# EAGLE schematic watchplb_mainboard_v1_0 (EAGLE 6.5.0)

## Sheet 1 of 8: MCU
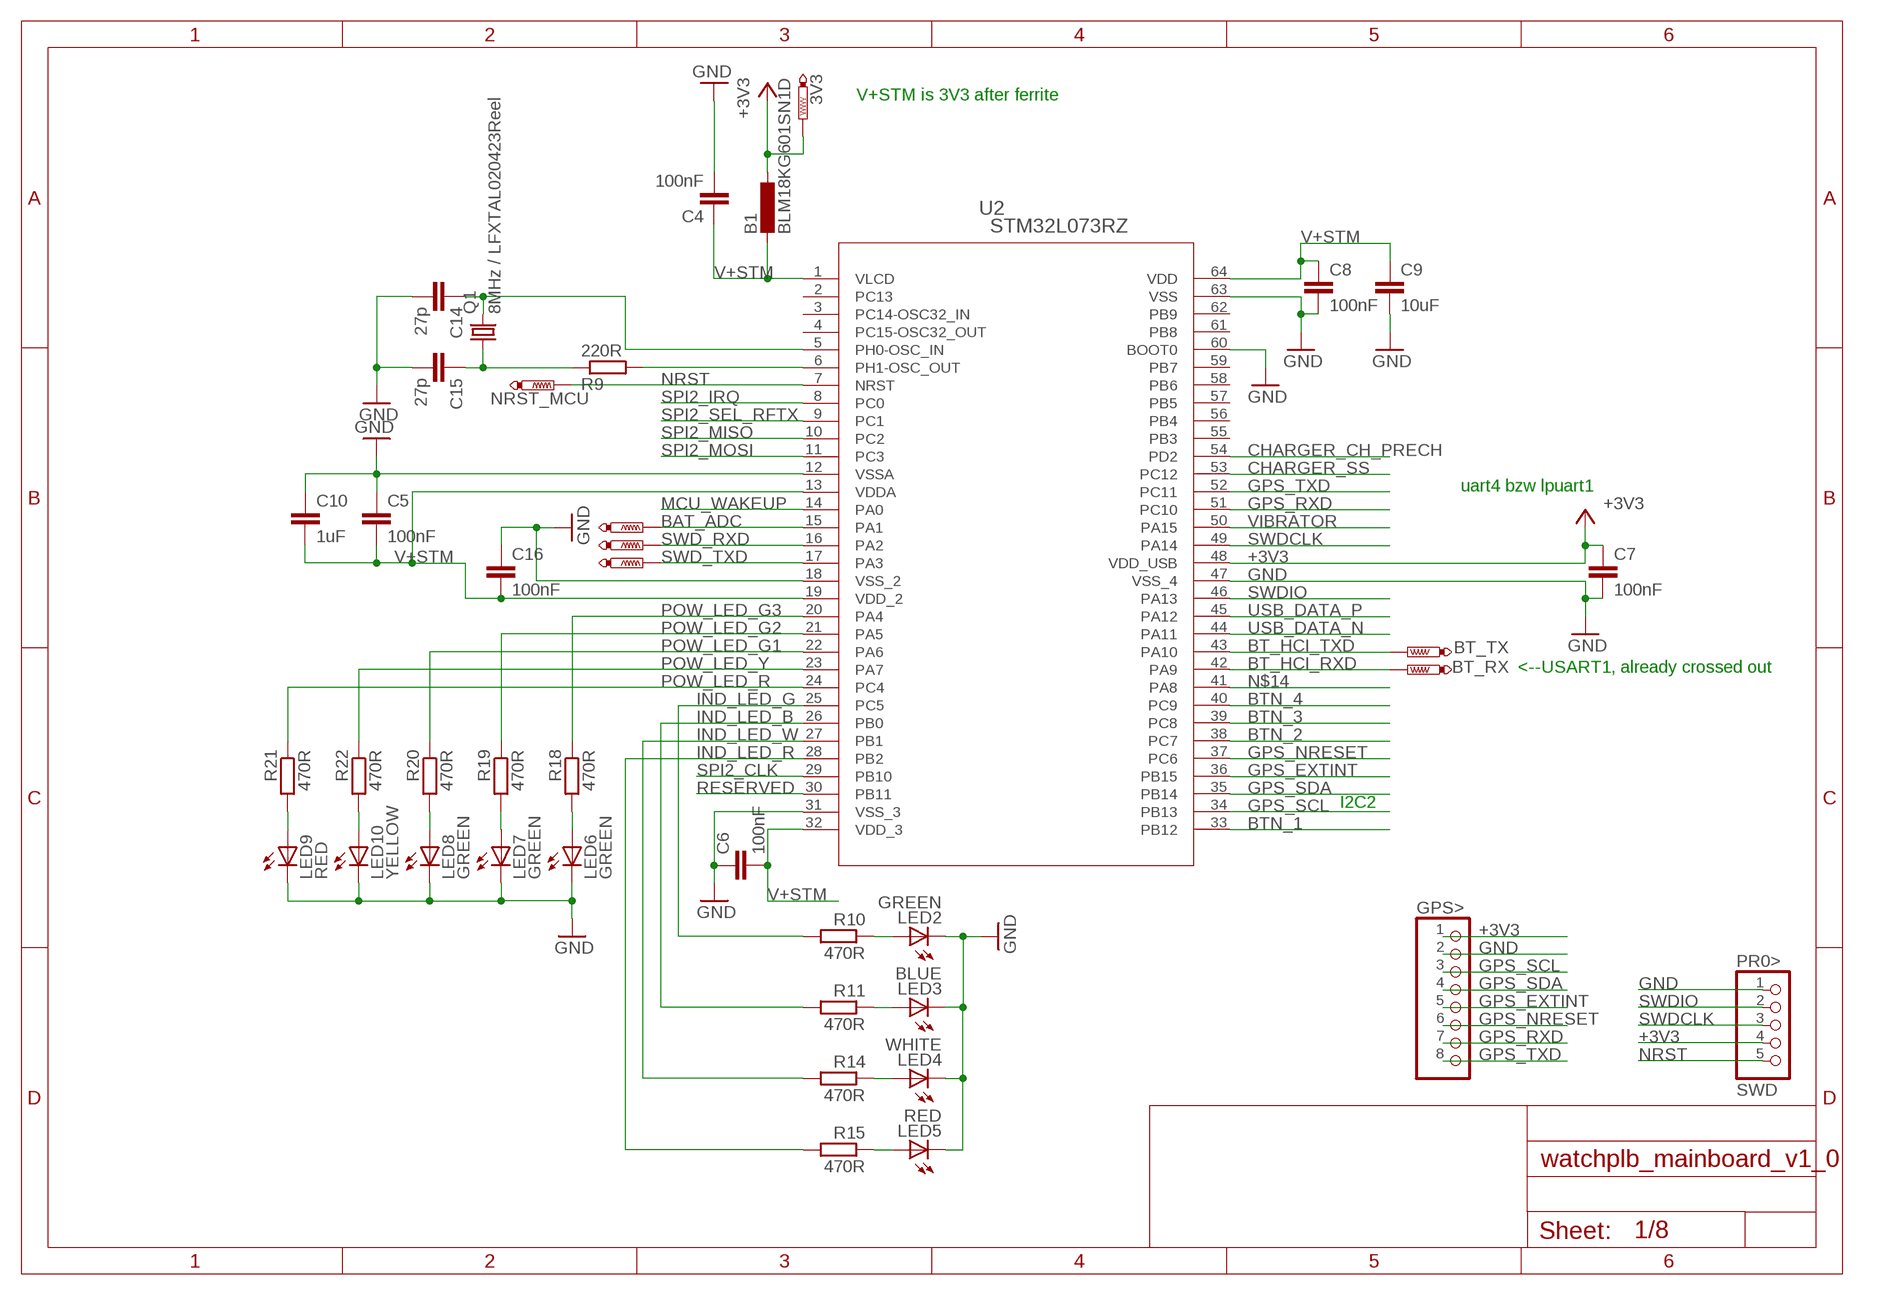
[diagram p0: schematic, sheet 1]

### Parts
3V3  PTR1B1,27  [B1,27]
B1  BLM18KG601SN1D  B-EU_B0603  [L0603]
BAT_ADC  PTR1B1,27  [B1,27]
BT_RX  PTR1B1,27  [B1,27]
BT_TX  PTR1B1,27  [B1,27]
C4  100nF  C-EUC0805  [C0805]
C5  100nF  C-EUC0805  [C0805]
C6  100nF  C-EUC0805  [C0805]
C7  100nF  C-EUC0805  [C0805]
C8  100nF  C-EUC0805  [C0805]
C9  10uF  C-EUC1206  [C1206]
C10  1uF  C-EUC0805  [C0805]
C14  27p  C-EUC0805  [C0805]
C15  27p  C-EUC0805  [C0805]
C16  100nF  C-EUC0805  [C0805]
GPS>  PINHD-1X8  [1X08]
LED2  GREEN  LEDCHIP-LED0805  [CHIP-LED0805]
LED3  BLUE  LEDCHIP-LED0805  [CHIP-LED0805]
LED4  WHITE  LEDCHIP-LED0805  [CHIP-LED0805]
LED5  RED  LEDCHIP-LED0805  [CHIP-LED0805]
LED6  GREEN  LEDCHIP-LED0805  [CHIP-LED0805]
LED7  GREEN  LEDCHIP-LED0805  [CHIP-LED0805]
LED8  GREEN  LEDCHIP-LED0805  [CHIP-LED0805]
LED9  RED  LEDCHIP-LED0805  [CHIP-LED0805]
LED10  YELLOW  LEDCHIP-LED0805  [CHIP-LED0805]
NRST_MCU  PTR1B1,27  [B1,27]
PR0>  SWD  PINHD-1X5  [1X05]
Q1  8MHz / LFXTAL020423Reel  CRYSTALHC49UP  [HC49UP]
R9  220R  R-EU_M0805  [M0805]
R10  470R  R-EU_M0805  [M0805]
R11  470R  R-EU_M0805  [M0805]
R14  470R  R-EU_M0805  [M0805]
R15  470R  R-EU_M0805  [M0805]
R18  470R  R-EU_M0805  [M0805]
R19  470R  R-EU_M0805  [M0805]
R20  470R  R-EU_M0805  [M0805]
R21  470R  R-EU_M0805  [M0805]
R22  470R  R-EU_M0805  [M0805]
SWD_RXD  PTR1B1,27  [B1,27]
SWD_TXD  PTR1B1,27  [B1,27]
U2  STM32L073RZ  STM32L0X3RL  [LQFP64-10X10MM]

### Nets
+3V3: 3V3.TP B1.1 C7.1 GPS>.1 PR0>.4 U2.48(VDD_USB) ; also sheet 2,3,4,5,6,8
BAT_ADC: BAT_ADC.TP U2.15(PA1) ; also sheet 8
BT_HCI_RXD: BT_RX.TP U2.42(PA9) ; also sheet 4
BT_HCI_TXD: BT_TX.TP U2.43(PA10) ; also sheet 4
BTN_1: U2.33(PB12) ; also sheet 3
BTN_2: U2.38(PC7) ; also sheet 3
BTN_3: U2.39(PC8) ; also sheet 3
BTN_4: U2.40(PC9) ; also sheet 3
CHARGER_CH_PRECH: U2.54(PD2) ; also sheet 5
CHARGER_SS: U2.53(PC12) ; also sheet 5
GND: C4.2 C5.1 C6.1 C7.2 C8.2 C9.2 C10.1 C14.2 C15.2 C16.1 GPS>.2 LED2.C LED3.C LED4.C LED5.C LED6.C LED7.C LED8.C LED9.C LED10.C PR0>.1 U2.12(VSSA) U2.18(VSS_2) U2.31(VSS_3) U2.47(VSS_4) U2.60(BOOT0) U2.63(VSS) ; also sheet 2,3,4,5,6,7,8
GPS_EXTINT: GPS>.5 U2.36(PB15)
GPS_NRESET: GPS>.6 U2.37(PC6)
GPS_RXD: GPS>.7 U2.51(PC10)
GPS_SCL: GPS>.3 U2.34(PB13)
GPS_SDA: GPS>.4 U2.35(PB14)
GPS_TXD: GPS>.8 U2.52(PC11)
IND_LED_B: R11.2 U2.26(PB0)
IND_LED_G: R10.2 U2.25(PC5)
IND_LED_R: R15.2 U2.28(PB2)
IND_LED_W: R14.2 U2.27(PB1)
MCU_WAKEUP: U2.14(PA0) ; also sheet 3
N$1: LED2.A R10.1
N$4: LED3.A R11.1
N$5: C15.1 Q1.1 R9.1
N$6: C14.1 Q1.2 U2.5(PH0-OSC_IN)
N$9: R9.2 U2.6(PH1-OSC_OUT)
N$12: LED4.A R14.1
N$13: LED9.A R21.2
N$14: U2.41(PA8)
N$16: LED5.A R15.1
N$19: LED6.A R18.2
N$22: LED7.A R19.2
N$24: LED10.A R22.2
N$25: LED8.A R20.2
NRST: NRST_MCU.TP PR0>.5 U2.7(NRST) ; also sheet 3
POW_LED_G1: R20.1 U2.22(PA6)
POW_LED_G2: R19.1 U2.21(PA5)
POW_LED_G3: R18.1 U2.20(PA4)
POW_LED_R: R21.1 U2.24(PC4)
POW_LED_Y: R22.1 U2.23(PA7)
RESERVED: U2.30(PB11)
SPI2_CLK: U2.29(PB10) ; also sheet 2
SPI2_IRQ: U2.8(PC0) ; also sheet 2
SPI2_MISO: U2.10(PC2) ; also sheet 2
SPI2_MOSI: U2.11(PC3) ; also sheet 2
SPI2_SEL_RFTX: U2.9(PC1) ; also sheet 2
SWD_RXD: SWD_RXD.TP U2.16(PA2)
SWD_TXD: SWD_TXD.TP U2.17(PA3)
SWDCLK: PR0>.3 U2.49(PA14)
SWDIO: PR0>.2 U2.46(PA13)
USB_DATA_N: U2.44(PA11) ; also sheet 6
USB_DATA_P: U2.45(PA12) ; also sheet 6
V+STM: B1.2 C4.1 C5.2 C6.2 C8.1 C9.1 C10.2 C16.2 U2.1(VLCD) U2.13(VDDA) U2.19(VDD_2) U2.32(VDD_3) U2.64(VDD)
VIBRATOR: U2.50(PA15) ; also sheet 3
Unconnected: U2.2(PC13) U2.3(PC14-OSC32_IN) U2.4(PC15-OSC32_OUT) U2.55(PB3) U2.56(PB4) U2.57(PB5) U2.58(PB6) U2.59(PB7) U2.61(PB8) U2.62(PB9)

### Notes on the sheet
- V+STM is 3V3 after ferrite
- uart4 bzw lpuart1
- <--USART1, already crossed out
- I2C2

## Sheet 2 of 8: FUNK
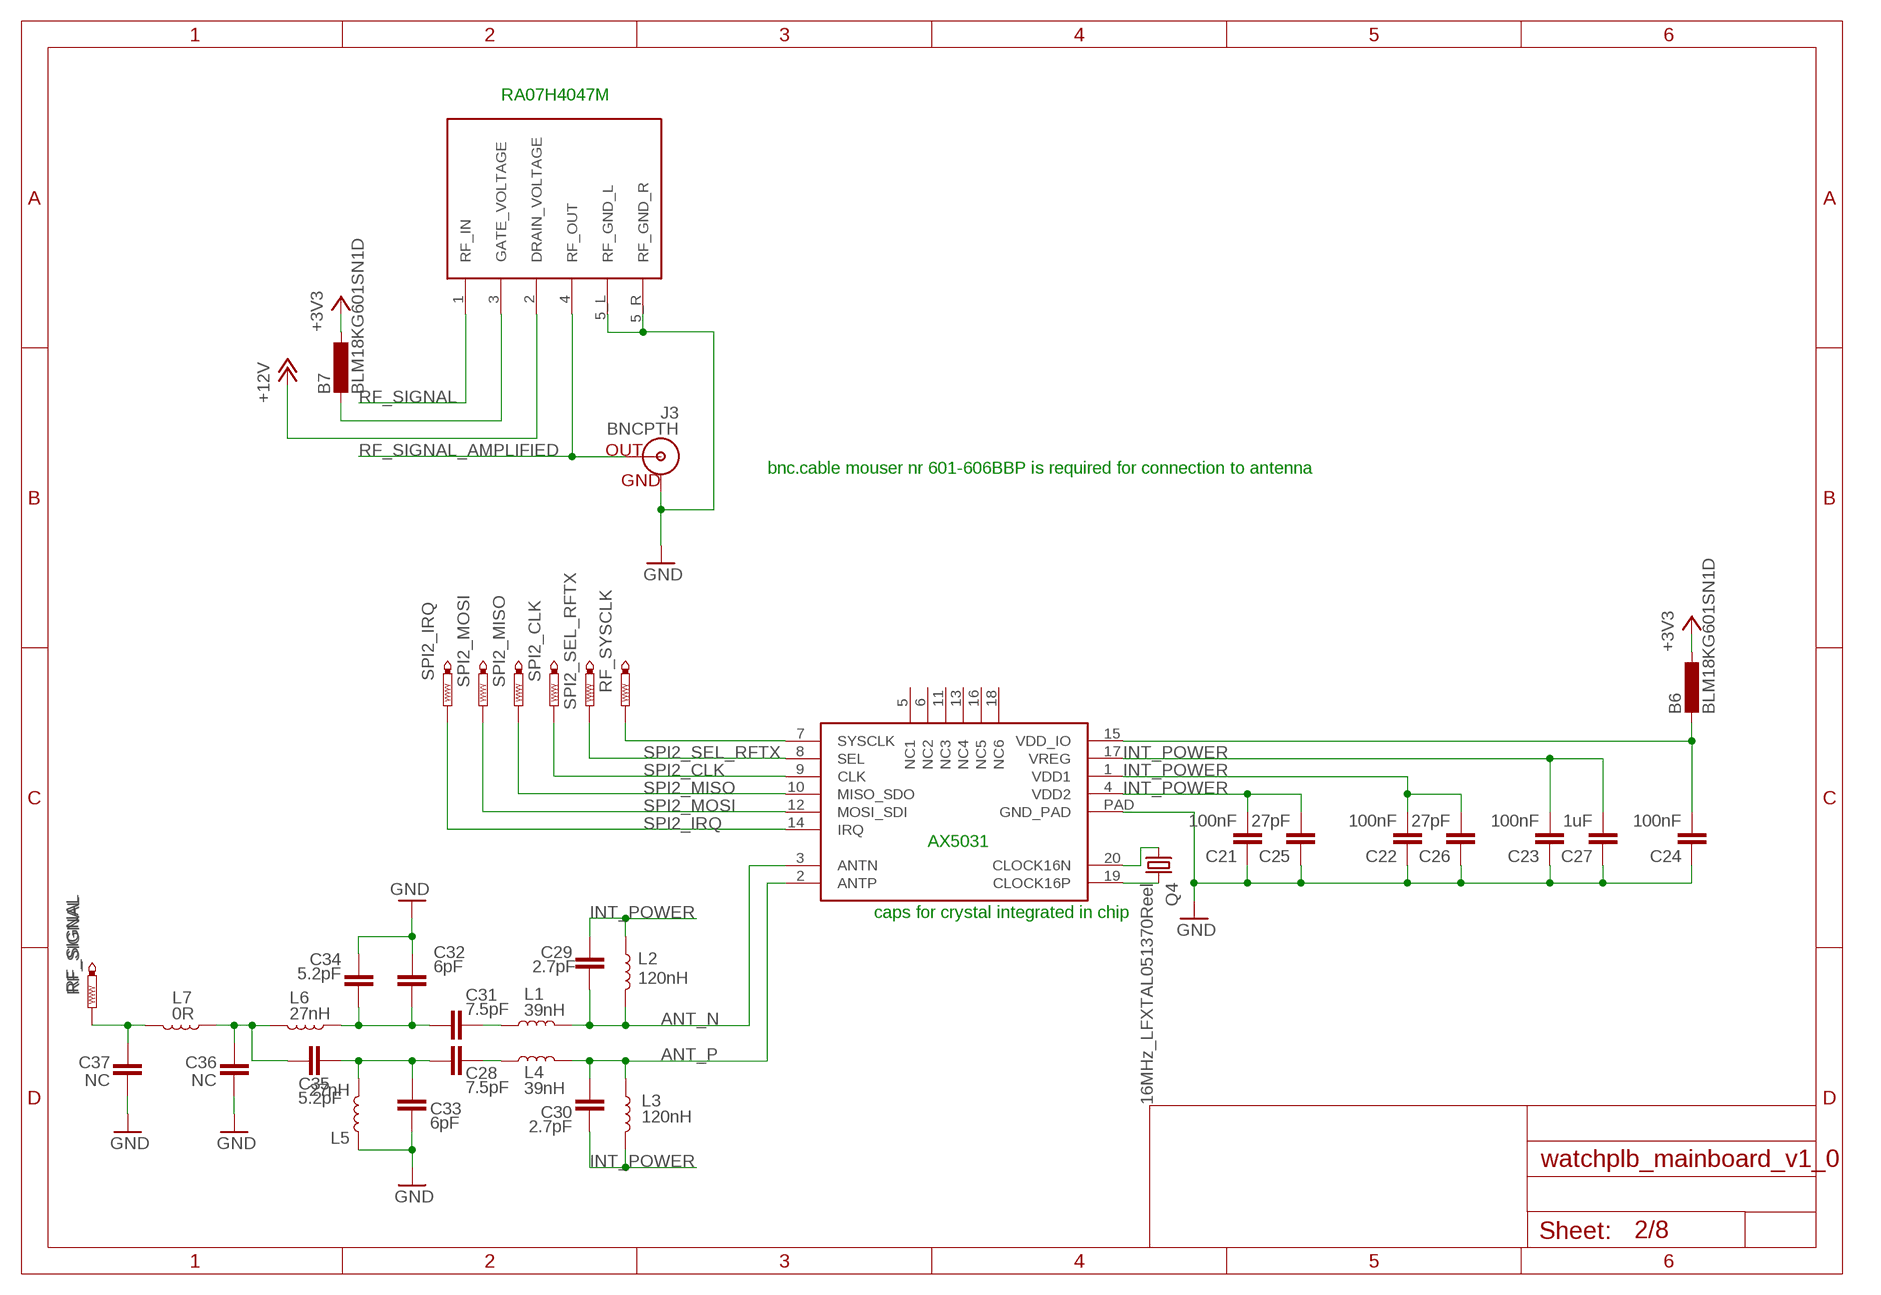
[diagram p1: schematic, sheet 2]

### Parts
B6  BLM18KG601SN1D  B-EU_B0603  [L0603]
B7  BLM18KG601SN1D  B-EU_B0603  [L0603]
C21  100nF  C-EUC0805  [C0805]
C22  100nF  C-EUC0805  [C0805]
C23  100nF  C-EUC0805  [C0805]
C24  100nF  C-EUC0805  [C0805]
C25  27pF  C-EUC0805  [C0805]
C26  27pF  C-EUC0805  [C0805]
C27  1uF  C-EUC0805  [C0805]
C28  7.5pF  C-EUC0805  [C0805]
C29  2.7pF  C-EUC0805  [C0805]
C30  2.7pF  C-EUC0805  [C0805]
C31  7.5pF  C-EUC0805  [C0805]
C32  6pF  C-EUC0805  [C0805]
C33  6pF  C-EUC0805  [C0805]
C34  5.2pF  C-EUC0805  [C0805]
C35  5.2pF  C-EUC0805  [C0805]
C36  NC  C-EUC0805  [C0805]
C37  NC  C-EUC0805  [C0805]
IC4  AX5031  [QFN20]
J3  BNCPTH  [BNC]
L1  39nH  INDUCTOR-0805-3.3UH  [0805]
L2  120nH  INDUCTOR-0805-3.3UH  [0805]
L3  120nH  INDUCTOR-0805-3.3UH  [0805]
L4  39nH  INDUCTOR-0805-3.3UH  [0805]
L5  27nH  INDUCTOR-0805-3.3UH  [0805]
L6  27nH  INDUCTOR-0805-3.3UH  [0805]
L7  0R  INDUCTOR-0805-3.3UH  [0805]
Q4  16MHz_LFXTAL051370Reel  CRYSTALHC49UP  [HC49UP]
RF_SIGNAL  PTR1B2,54  [B2,54]
RF_SYSCLK  PTR1B1,27  [B1,27]
SPI2_CLK  PTR1B1,27  [B1,27]
SPI2_IRQ  PTR1B1,27  [B1,27]
SPI2_MISO  PTR1B1,27  [B1,27]
SPI2_MOSI  PTR1B1,27  [B1,27]
SPI2_SEL_RFTX  PTR1B1,27  [B1,27]
U$2  RA07H4047M  [RA07H4047M]

### Nets
+3V3: B6.1 B7.1 ; also sheet 1,3,4,5,6,8
+12V: U$2.2(DRAIN_VOLTAGE) ; also sheet 8
ANT_N: C29.1 IC4.3(ANTN) L1.2 L2.2
ANT_P: C30.2 IC4.2(ANTP) L3.1 L4.2
GND: C21.1 C22.1 C23.1 C24.1 C25.1 C26.1 C27.1 C32.1 C33.2 C34.1 C36.1 C37.1 IC4.PAD(GND_PAD) J3.GND L5.1 U$2.5_L(RF_GND_L) U$2.5_R(RF_GND_R) ; also sheet 1,3,4,5,6,7,8
INT_POWER: C21.2 C22.2 C23.2 C25.2 C26.2 C27.2 C29.2 C30.1 IC4.1(VDD1) IC4.4(VDD2) IC4.17(VREG) L2.1 L3.2
N$33: IC4.19(CLOCK16P) Q4.2
N$34: IC4.20(CLOCK16N) Q4.1
N$37: IC4.7(SYSCLK) RF_SYSCLK.TP
N$39: C28.1 L4.1
N$40: C31.1 L1.1
N$42: C31.2 C32.2 C34.2 L6.1
N$43: C28.2 C33.1 C35.2 L5.2
N$45: C35.1 C36.2 L6.2 L7.1
N$82: B6.2 C24.2 IC4.15(VDD_IO)
N$83: B7.2 U$2.3(GATE_VOLTAGE)
RF_SIGNAL: C37.2 L7.2 RF_SIGNAL.TP U$2.1(RF_IN)
RF_SIGNAL_AMPLIFIED: J3.S(OUT) U$2.4(RF_OUT)
SPI2_CLK: IC4.9(CLK) SPI2_CLK.TP ; also sheet 1
SPI2_IRQ: IC4.14(IRQ) SPI2_IRQ.TP ; also sheet 1
SPI2_MISO: IC4.10(MISO_SDO) SPI2_MISO.TP ; also sheet 1
SPI2_MOSI: IC4.12(MOSI_SDI) SPI2_MOSI.TP ; also sheet 1
SPI2_SEL_RFTX: IC4.8(SEL) SPI2_SEL_RFTX.TP ; also sheet 1
Unconnected: IC4.5(NC1) IC4.6(NC2) IC4.11(NC3) IC4.13(NC4) IC4.16(NC5) IC4.18(NC6)

### Notes on the sheet
- RA07H4047M
- bnc.cable mouser nr 601-606BBP is required for connection to antenna
- AX5031
- caps for crystal integrated in chip

## Sheet 3 of 8: BTN
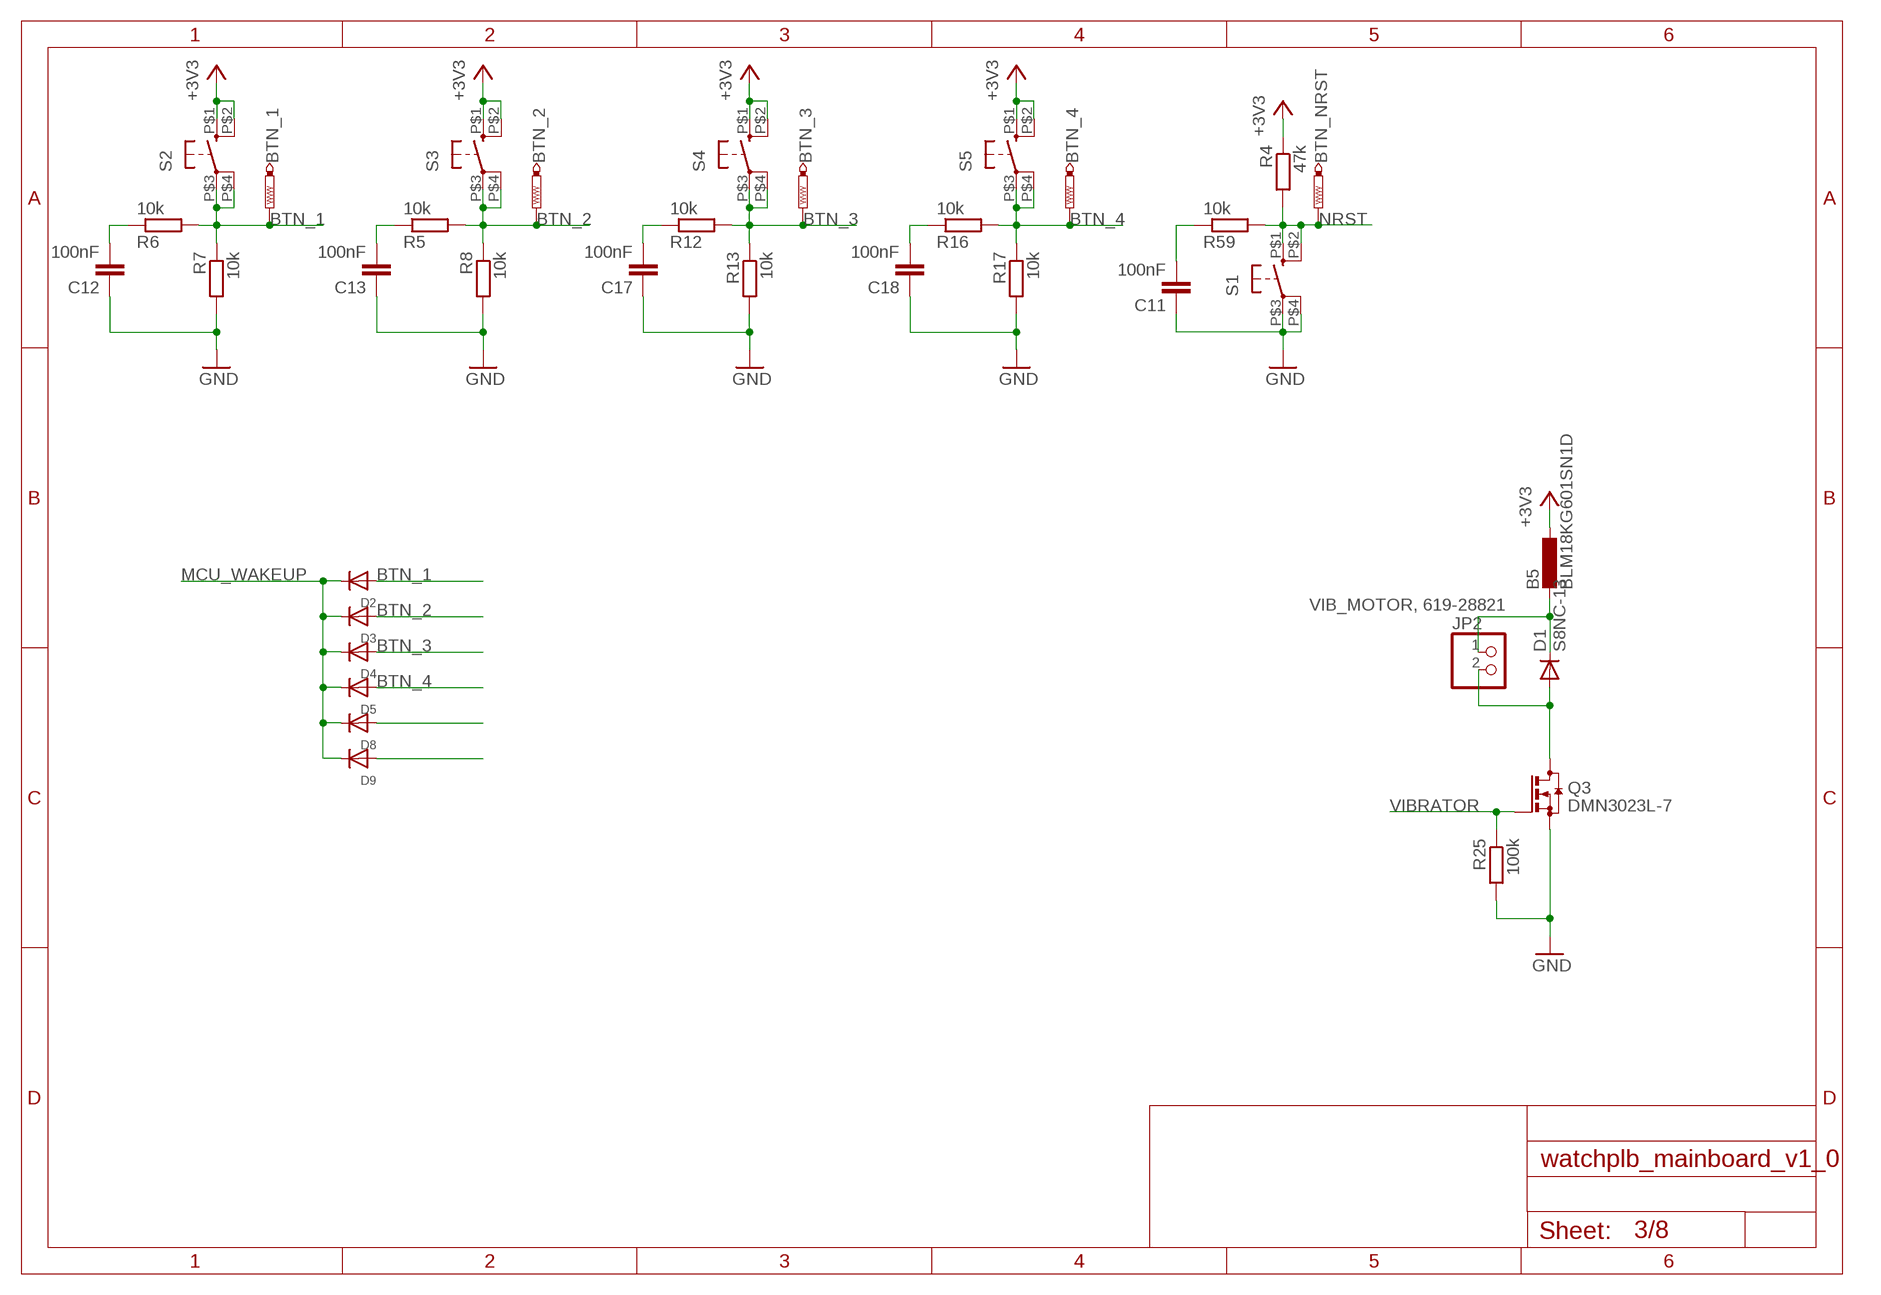
[diagram p2: schematic, sheet 3]

### Parts
B5  BLM18KG601SN1D  B-EU_B0603  [L0603]
BTN_1  PTR1B1,27  [B1,27]
BTN_2  PTR1B1,27  [B1,27]
BTN_3  PTR1B1,27  [B1,27]
BTN_4  PTR1B1,27  [B1,27]
BTN_NRST  PTR1B1,27  [B1,27]
C11  100nF  C-EUC0805  [C0805]
C12  100nF  C-EUC0805  [C0805]
C13  100nF  C-EUC0805  [C0805]
C17  100nF  C-EUC0805  [C0805]
C18  100nF  C-EUC0805  [C0805]
D1  S8NC-13  DIODE-SMC  [SMC]
D2  DIODESOD-123  [SOD-123]
D3  DIODESOD-123  [SOD-123]
D4  DIODESOD-123  [SOD-123]
D5  DIODESOD-123  [SOD-123]
D8  DIODESOD-123  [SOD-123]
D9  DIODESOD-123  [SOD-123]
JP2  VIB_MOTOR, 619-28821  PINHD-1X2  [1X02]
Q3  DMN3023L-7  BSS123  [SOT23]
R4  47k  R-EU_M0805  [M0805]
R5  10k  R-EU_M0805  [M0805]
R6  10k  R-EU_M0805  [M0805]
R7  10k  R-EU_M0805  [M0805]
R8  10k  R-EU_M0805  [M0805]
R12  10k  R-EU_M0805  [M0805]
R13  10k  R-EU_M0805  [M0805]
R16  10k  R-EU_M0805  [M0805]
R17  10k  R-EU_M0805  [M0805]
R25  100k  R-EU_M0805  [M0805]
R59  10k  R-EU_M0805  [M0805]
S1  TL3305  [SMD_SWITCH]
S2  TL3305  [SMD_SWITCH]
S3  TL3305  [SMD_SWITCH]
S4  TL3305  [SMD_SWITCH]
S5  TL3305  [SMD_SWITCH]

### Nets
+3V3: B5.1 R4.1 S2.P$1(SL1) S2.P$2(SL2) S3.P$1(SL1) S3.P$2(SL2) S4.P$1(SL1) S4.P$2(SL2) S5.P$1(SL1) S5.P$2(SL2) ; also sheet 1,2,4,5,6,8
BTN_1: BTN_1.TP D2.A R6.2 R7.1 S2.P$3(SR1) S2.P$4(SR2) ; also sheet 1
BTN_2: BTN_2.TP D3.A R5.2 R8.1 S3.P$3(SR1) S3.P$4(SR2) ; also sheet 1
BTN_3: BTN_3.TP D4.A R12.2 R13.1 S4.P$3(SR1) S4.P$4(SR2) ; also sheet 1
BTN_4: BTN_4.TP D5.A R16.2 R17.1 S5.P$3(SR1) S5.P$4(SR2) ; also sheet 1
GND: C11.1 C12.1 C13.1 C17.1 C18.1 Q3.2(S) R7.2 R8.2 R13.2 R17.2 R25.2 S1.P$3(SR1) S1.P$4(SR2) ; also sheet 1,2,4,5,6,7,8
MCU_WAKEUP: D2.C D3.C D4.C D5.C D8.C D9.C ; also sheet 1
N$2: C12.2 R6.1
N$7: C13.2 R5.1
N$11: C17.2 R12.1
N$18: C18.2 R16.1
N$28: D1.A JP2.2 Q3.3(D)
N$67: D8.A
N$68: D9.A
N$81: B5.2 D1.C JP2.1
N$86: C11.2 R59.1
NRST: BTN_NRST.TP R4.2 R59.2 S1.P$1(SL1) S1.P$2(SL2) ; also sheet 1
VIBRATOR: Q3.1(G) R25.1 ; also sheet 1

## Sheet 4 of 8: BT
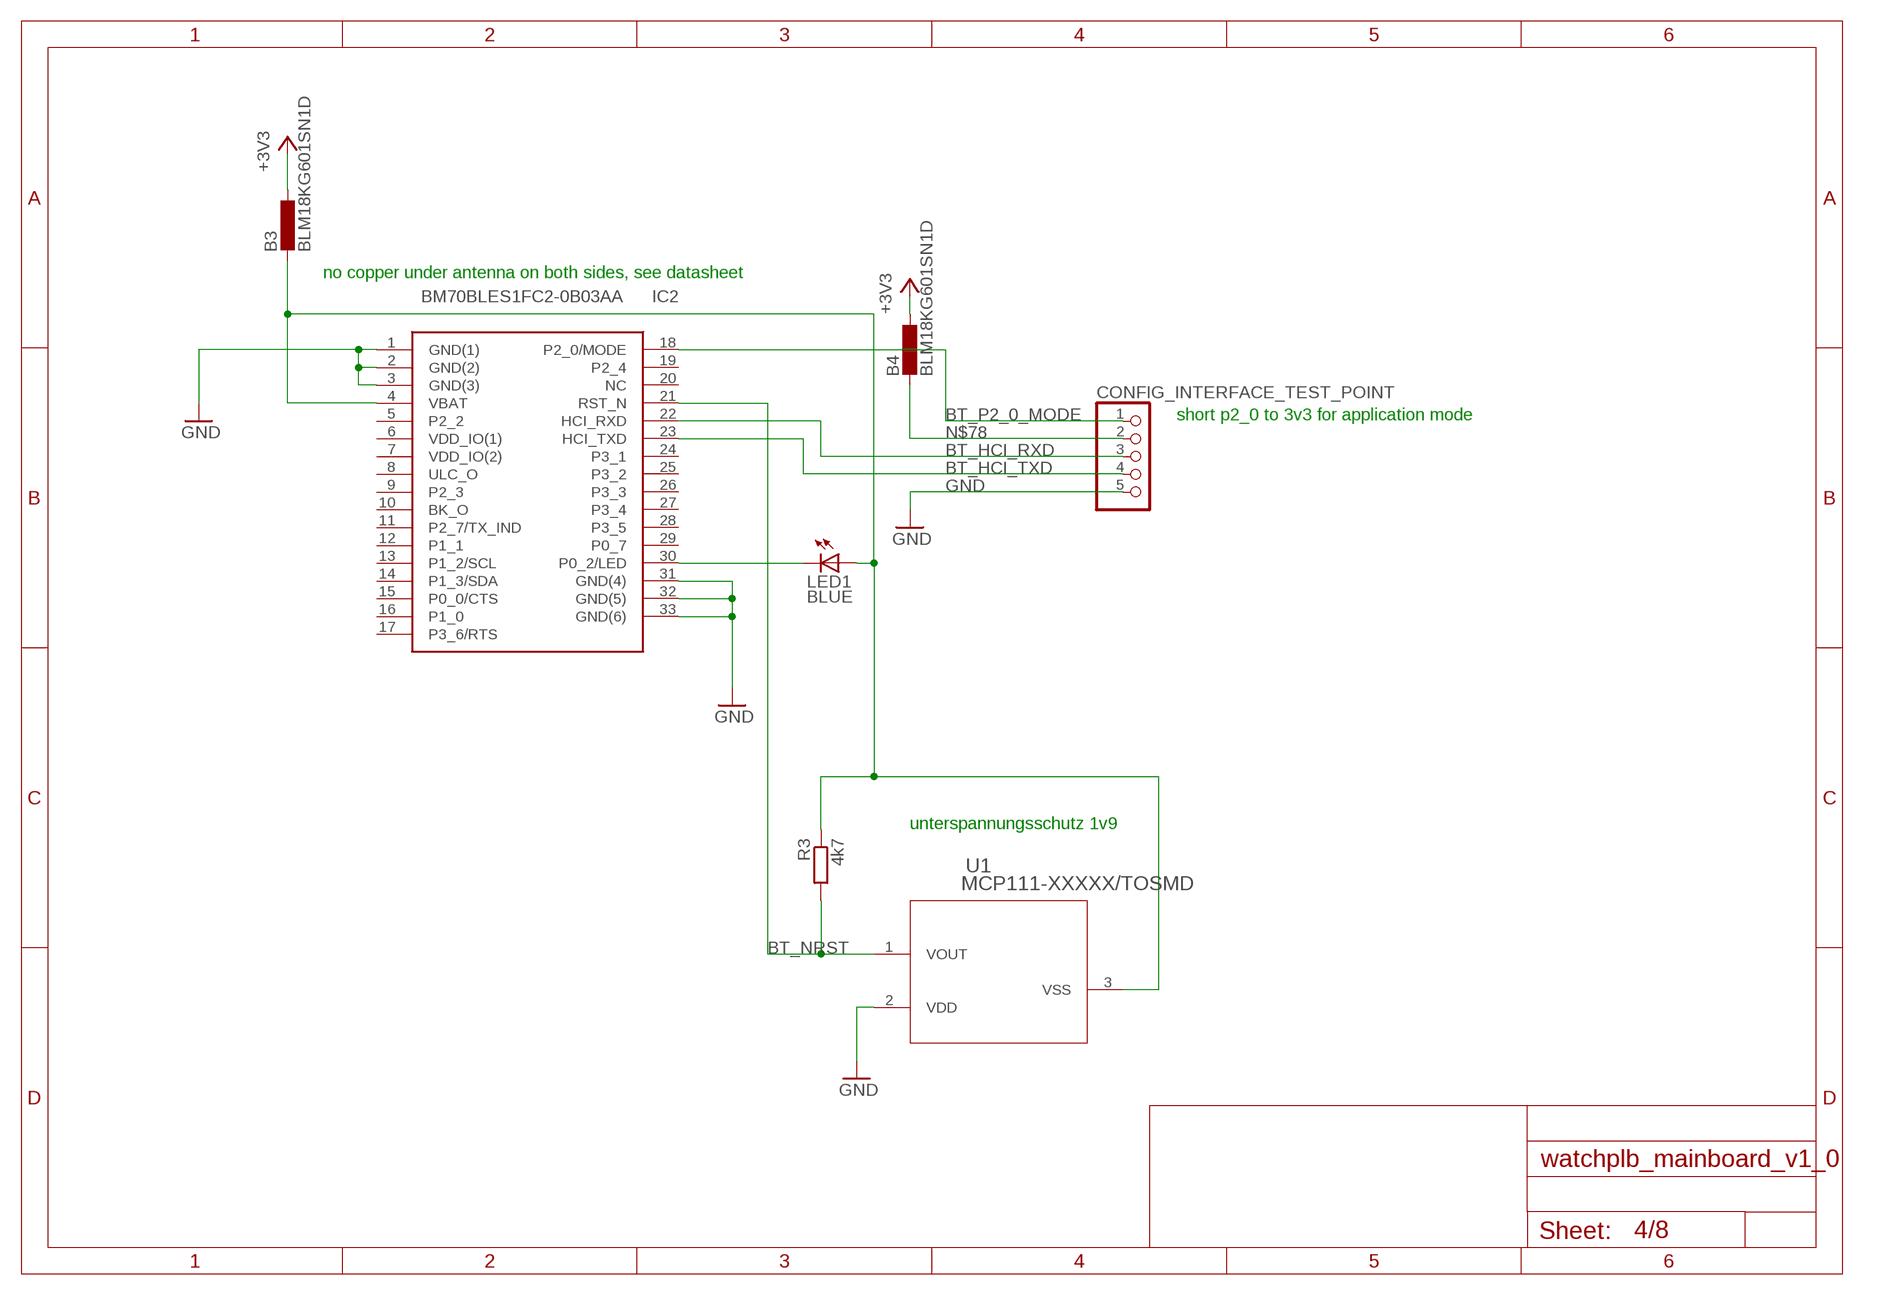
[diagram p3: schematic, sheet 4]

### Parts
B3  BLM18KG601SN1D  B-EU_B0603  [L0603]
B4  BLM18KG601SN1D  B-EU_B0603  [L0603]
CONFIG_INTERFACE_TEST_POINT  PINHD-1X5  [1X05]
IC2  BM70BLES1FC2-0B03AA  [BM78SPPS5NC2_1]
LED1  BLUE  LEDCHIP-LED0805  [CHIP-LED0805]
R3  4k7  R-EU_M0805  [M0805]
U1  MCP111-XXXXX/TOSMD  [SC70-3-R]

### Nets
+3V3: B3.1 B4.1 ; also sheet 1,2,3,5,6,8
BT_HCI_RXD: CONFIG_INTERFACE_TEST_POINT.3 IC2.22(HCI_RXD) ; also sheet 1
BT_HCI_TXD: CONFIG_INTERFACE_TEST_POINT.4 IC2.23(HCI_TXD) ; also sheet 1
BT_NRST: IC2.21(RST_N) R3.2 U1.1(VOUT)
BT_P2_0_MODE: CONFIG_INTERFACE_TEST_POINT.1 IC2.18(P2_0/MODE)
GND: CONFIG_INTERFACE_TEST_POINT.5 IC2.1(GND(1)) IC2.2(GND(2)) IC2.3(GND(3)) IC2.31(GND(4)) IC2.32(GND(5)) IC2.33(GND(6)) U1.2(VDD) ; also sheet 1,2,3,5,6,7,8
N$3: IC2.30(P0_2/LED) LED1.C
N$78: B4.2 CONFIG_INTERFACE_TEST_POINT.2
N$80: B3.2 IC2.4(VBAT) LED1.A R3.1 U1.3(VSS)
Unconnected: IC2.5(P2_2) IC2.6(VDD_IO(1)) IC2.7(VDD_IO(2)) IC2.8(ULC_O) IC2.9(P2_3) IC2.10(BK_O) IC2.11(P2_7/TX_IND) IC2.12(P1_1) IC2.13(P1_2/SCL) IC2.14(P1_3/SDA) IC2.15(P0_0/CTS) IC2.16(P1_0) IC2.17(P3_6/RTS) IC2.19(P2_4) IC2.20(NC) IC2.24(P3_1) IC2.25(P3_2) IC2.26(P3_3) IC2.27(P3_4) IC2.28(P3_5) IC2.29(P0_7)

### Notes on the sheet
- no copper under antenna on both sides, see datasheet
- short p2_0 to 3v3 for application mode
- unterspannungsschutz 1v9

## Sheet 5 of 8: CHG
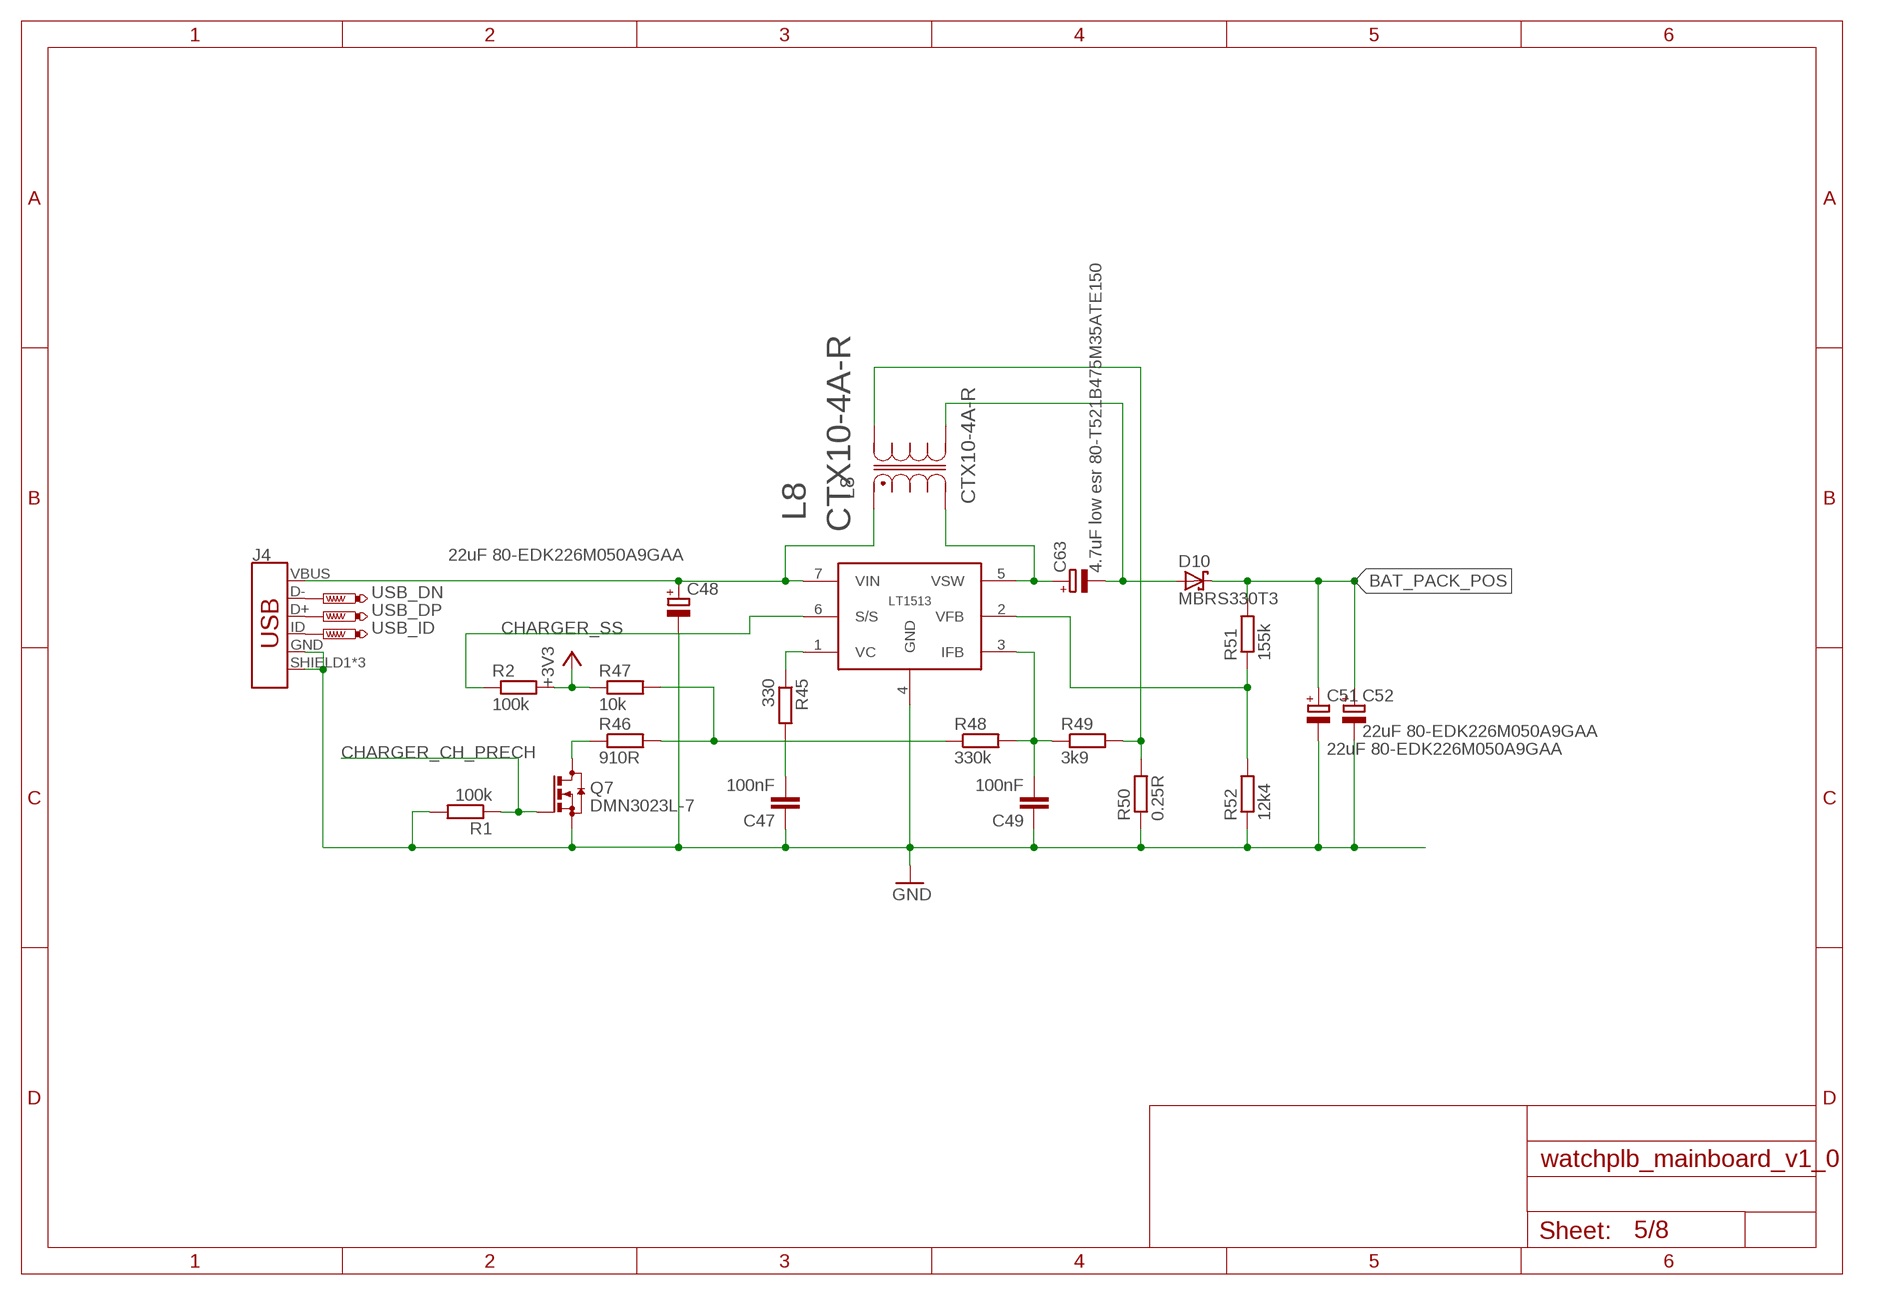
[diagram p4: schematic, sheet 5]

### Parts
C47  100nF  C-EUC0805K  [C0805K]
C48  22uF 80-EDK226M050A9GAA  CPOL-EUE  [PANASONIC_E]
C49  100nF  C-EUC0805K  [C0805K]
C51  22uF 80-EDK226M050A9GAA  CPOL-EUE  [PANASONIC_E]
C52  22uF 80-EDK226M050A9GAA  CPOL-EUE  [PANASONIC_E]
C63  4.7uF low esr 80-T521B475M35ATE150  CPOL-EUB/3528-21R  [B/3528-21R]
D10  MBRS330T3  [SMC]
IC1  LT1513  [TO220-7]
J4  USB_MICRO-B_FEMALE-SMT  [USB-B-MICRO-SMD]
L8  CTX10-4A-R  [INDM115115X635N]
Q7  DMN3023L-7  BSS123  [SOT23]
R1  100k  R-EU_M0805  [M0805]
R2  100k  R-EU_M0805  [M0805]
R45  330  R-EU_M0805  [M0805]
R46  910R  R-EU_M0805  [M0805]
R47  10k  R-EU_M0805  [M0805]
R48  330k  R-EU_M0805  [M0805]
R49  3k9  R-EU_M0805  [M0805]
R50  0.25R  R-EU_R2512  [R2512]
R51  155k  R-EU_M0805  [M0805]
R52  12k4  R-EU_M0805  [M0805]
USB_DN  PTR1B1,27  [B1,27]
USB_DP  PTR1B1,27  [B1,27]
USB_ID  PTR1B1,27  [B1,27]

### Nets
+3V3: R2.2 R47.1 ; also sheet 1,2,3,4,6,8
BAT_PACK_POS: C51.+ C52.+ D10.C R51.2 ; also sheet 7,8
CHARGER_CH_PRECH: Q7.1(G) R1.1 ; also sheet 1
CHARGER_SS: IC1.6(S/S) R2.1 ; also sheet 1
GND: C47.1 C48.- C49.1 C51.- C52.- IC1.4(GND) J4.GND J4.SHIELD1(SHIELD) J4.SHIELD2(SHIELD) J4.SHIELD3(SHIELD) Q7.2(S) R1.2 R50.1 R52.1 ; also sheet 1,2,3,4,6,7,8
N$61: C63.+ IC1.5(VSW) L8.2
N$69: C48.+ IC1.7(VIN) J4.VBUS L8.1
N$70: L8.4 R49.2 R50.2
N$71: C47.2 R45.2
N$72: IC1.1(VC) R45.1
N$73: Q7.3(D) R46.1
N$74: R46.2 R47.2 R48.1
N$76: C49.2 IC1.3(IFB) R48.2 R49.1
N$77: IC1.2(VFB) R51.1 R52.2
N$87: J4.ID USB_ID.TP
N$88: J4.D+ USB_DP.TP
N$90: J4.D- USB_DN.TP
N$91: C63.- D10.A L8.3

## Sheet 6 of 8: Debug
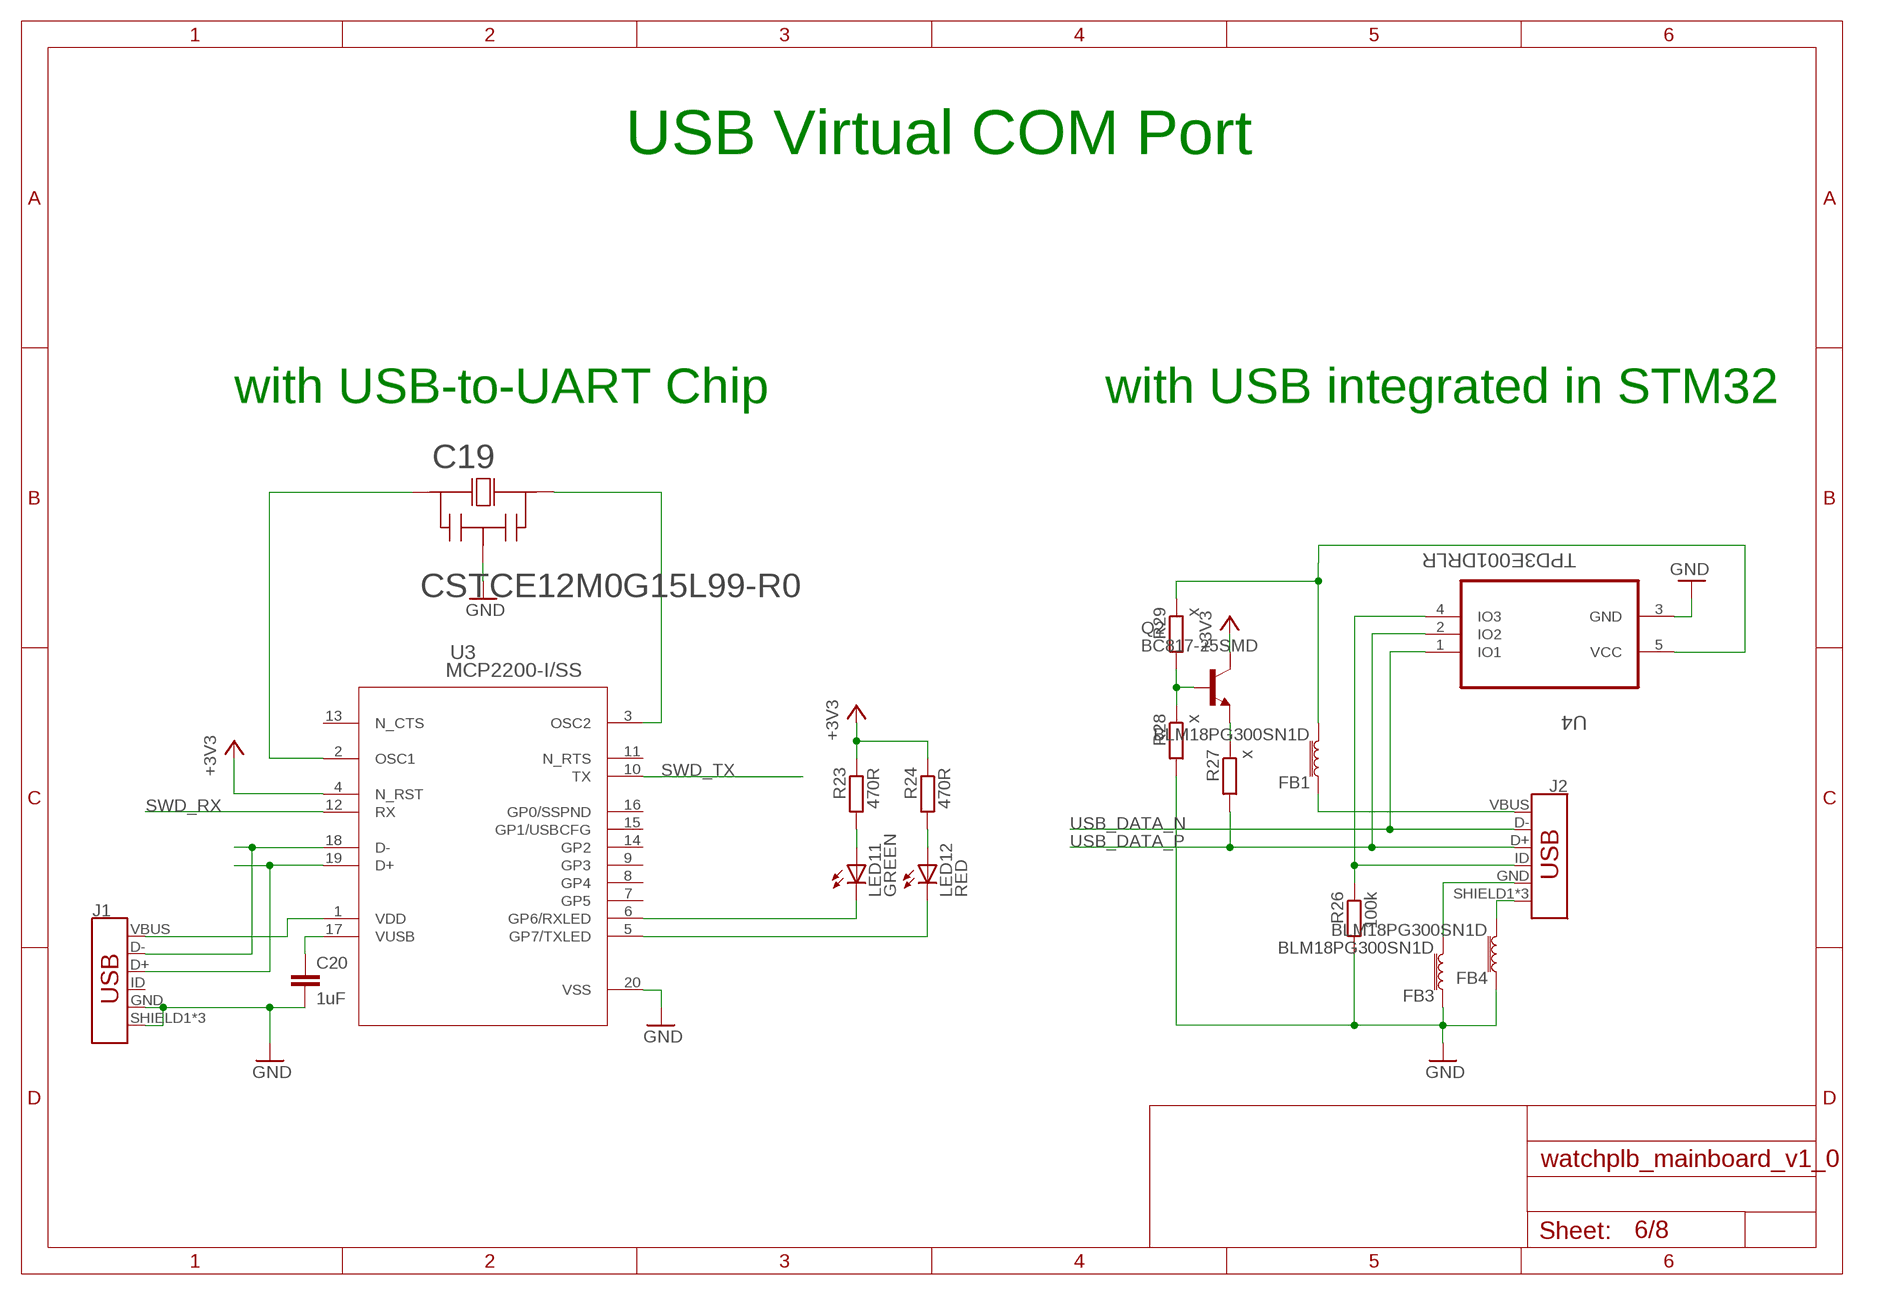
[diagram p5: schematic, sheet 6]

### Parts
C19  CSTCE12M0G15L99-R0  CSTCE8M00G52-R0  [CSTCE]
C20  1uF  C-EUC0805  [C0805]
FB1  BLM18PG300SN1D  FERRITE_BEAD-0603  [0603]
FB3  BLM18PG300SN1D  FERRITE_BEAD-0603  [0603]
FB4  BLM18PG300SN1D  FERRITE_BEAD-0603  [0603]
J1  USB_MICRO-B_FEMALE-SMT  [USB-B-MICRO-SMD]
J2  USB_MICRO-B_FEMALE-SMT  [USB-B-MICRO-SMD]
LED11  GREEN  LEDCHIP-LED0805  [CHIP-LED0805]
LED12  RED  LEDCHIP-LED0805  [CHIP-LED0805]
Q2  BC817-25SMD  [SOT23-BEC]
R23  470R  R-EU_M0805  [M0805]
R24  470R  R-EU_M0805  [M0805]
R26  100k  R-EU_M0805  [M0805]
R27  x  R-EU_M0805  [M0805]
R28  x  R-EU_M0805  [M0805]
R29  x  R-EU_M0805  [M0805]
U3  MCP2200-I/SS  [SSOP20_MC]
U4  TPD3E001DRLR  [SOT50P160X60-5N]

### Nets
+3V3: Q2.C R23.1 R24.1 U3.4(N_RST) ; also sheet 1,2,3,4,5,8
GND: C19.2 C20.2 FB3.1 FB4.1 J1.GND J1.SHIELD1(SHIELD) J1.SHIELD2(SHIELD) J1.SHIELD3(SHIELD) R26.2 R28.2 U3.20(VSS) U4.3(GND) ; also sheet 1,2,3,4,5,7,8
N$8: LED11.A R23.2
N$10: C19.3 U3.3(OSC2)
N$15: C19.1 U3.2(OSC1)
N$17: J1.D- U3.18(D-)
N$20: J1.D+ U3.19(D+)
N$21: C20.1 U3.17(VUSB)
N$23: LED12.A R24.2
N$26: LED11.C U3.6(GP6/RXLED)
N$27: LED12.C U3.5(GP7/TXLED)
N$29: FB4.2 J2.SHIELD1(SHIELD) J2.SHIELD2(SHIELD) J2.SHIELD3(SHIELD)
N$30: FB3.2 J2.GND
N$31: FB1.1 J2.VBUS
N$32: J2.ID R26.1 U4.4(IO3)
N$35: Q2.E R27.1
N$36: Q2.B R28.1 R29.2
N$41: J1.VBUS U3.1(VDD)
N$44: FB1.2 R29.1 U4.5(VCC)
SWD_RX: U3.12(RX)
SWD_TX: U3.10(TX)
USB_DATA_N: J2.D- U4.1(IO1) ; also sheet 1
USB_DATA_P: J2.D+ R27.2 U4.2(IO2) ; also sheet 1
Unconnected: J1.ID U3.7(GP5) U3.8(GP4) U3.9(GP3) U3.11(N_RTS) U3.13(N_CTS) U3.14(GP2) U3.15(GP1/USBCFG) U3.16(GP0/SSPND)

### Notes on the sheet
- USB Virtual COM Port
- with USB-to-UART Chip | with USB integrated in STM32

## Sheet 7 of 8: Bat. Prot.
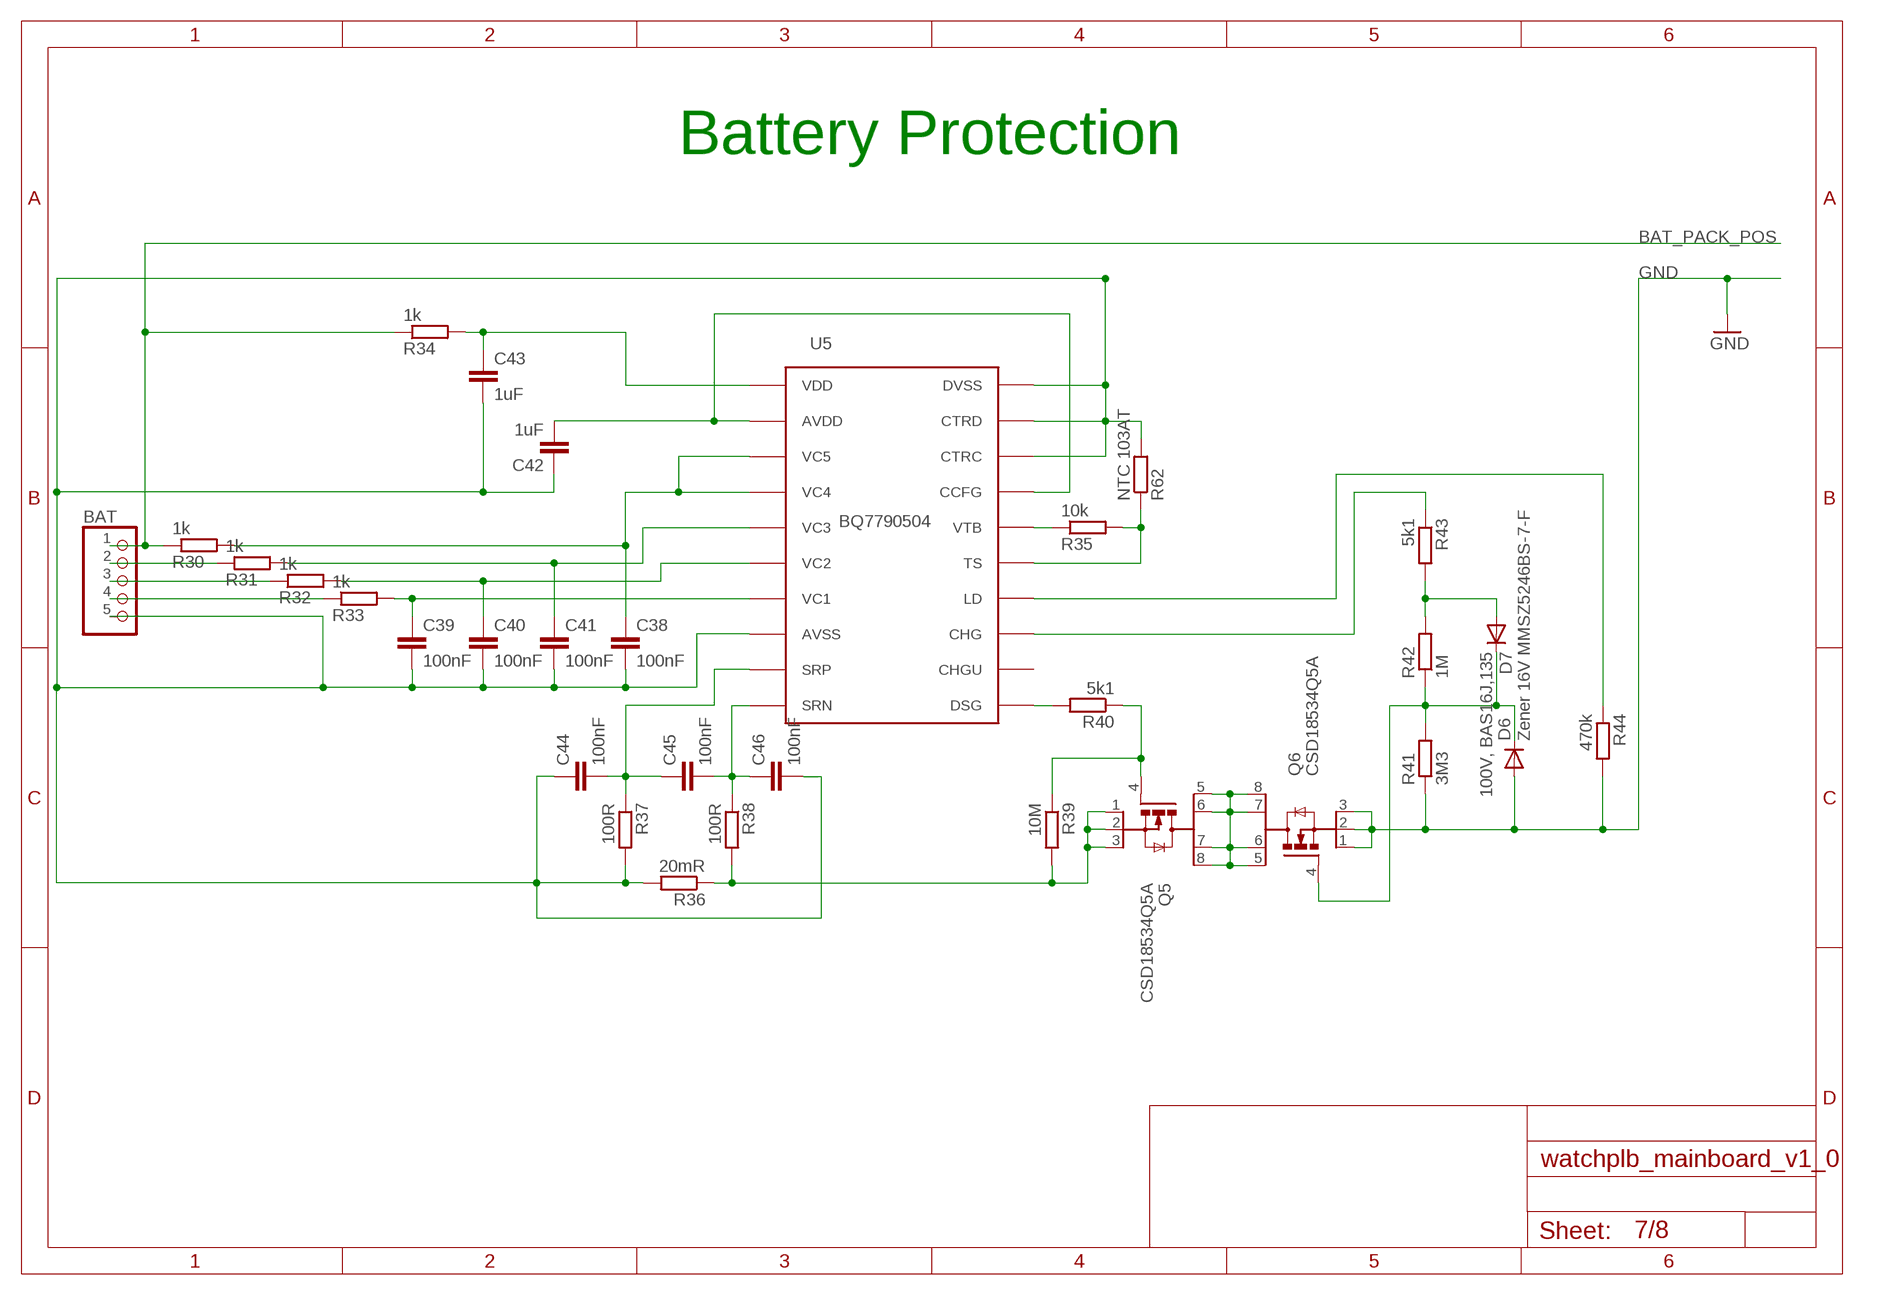
[diagram p6: schematic, sheet 7]

### Parts
BAT  PINHD-1X5  [1X05]
C38  100nF  C-EUC0805K  [C0805K]
C39  100nF  C-EUC0805K  [C0805K]
C40  100nF  C-EUC0805K  [C0805K]
C41  100nF  C-EUC0805K  [C0805K]
C42  1uF  C-EUC0805K  [C0805K]
C43  1uF  C-EUC0805K  [C0805K]
C44  100nF  C-EUC0805K  [C0805K]
C45  100nF  C-EUC0805K  [C0805K]
C46  100nF  C-EUC0805K  [C0805K]
D6  Zener 16V MMSZ5246BS-7-F  DIODE-SOD323-R  [SOD323-R]
D7  100V, BAS16J,135  DIODE-SOD323-R  [SOD323-R]
Q5  CSD18534Q5A  [TRANS_CSD18534Q5A]
Q6  CSD18534Q5A  [TRANS_CSD18534Q5A]
R30  1k  R-EU_M0805  [M0805]
R31  1k  R-EU_M0805  [M0805]
R32  1k  R-EU_M0805  [M0805]
R33  1k  R-EU_M0805  [M0805]
R34  1k  R-EU_M0805  [M0805]
R35  10k  R-EU_M0805  [M0805]
R36  20mR  R-EU_R2512  [R2512]
R37  100R  R-EU_M0805  [M0805]
R38  100R  R-EU_M0805  [M0805]
R39  10M  R-EU_M0805  [M0805]
R40  5k1  R-EU_M0805  [M0805]
R41  3M3  R-EU_M0805  [M0805]
R42  1M  R-EU_M0805  [M0805]
R43  5k1  R-EU_M0805  [M0805]
R44  470k  R-EU_M0805  [M0805]
R62  NTC 103AT  R-EU_M0805  [M0805]
U5  BQ7790504  BQ77904  [TSSOP-20/6MM]

### Nets
BAT_PACK_GND: BAT.5 C38.2 C39.2 C40.2 C41.2 C42.1 C43.2 C44.1 C46.2 R36.2 R37.2 R62.2 U5.8(AVSS) U5.18(CTRC) U5.19(CTRD) U5.20(DVSS)
BAT_PACK_POS: BAT.1 R30.1 R34.1 ; also sheet 5,8
GND: D6.A Q6.1 Q6.2 Q6.3 R41.1 R44.2 ; also sheet 1,2,3,4,5,6,8
N$38: R35.2 R62.1 U5.15(TS)
N$46: D6.C D7.C Q6.4 R41.2 R42.1
N$47: BAT.2 R31.1
N$48: BAT.3 R32.1
N$49: BAT.4 R33.1
N$50: C39.1 R33.2 U5.7(VC1)
N$51: C40.1 R32.2 U5.6(VC2)
N$52: C41.1 R31.2 U5.5(VC3)
N$53: C38.1 R30.2 U5.3(VC5) U5.4(VC4)
N$54: C43.1 R34.2 U5.1(VDD)
N$55: Q5.1 Q5.2 Q5.3 R36.1 R38.2 R39.2
N$56: C42.2 U5.2(AVDD) U5.17(CCFG)
N$57: C45.2 C46.1 R38.1 U5.10(SRN)
N$58: C44.2 C45.1 R37.1 U5.9(SRP)
N$59: Q5.5 Q5.6 Q5.7 Q5.8 Q6.5 Q6.6 Q6.7 Q6.8
N$60: R35.1 U5.16(VTB)
N$62: Q5.4 R39.1 R40.1
N$63: R40.2 U5.11(DSG)
N$64: D7.A R42.2 R43.2
N$65: R43.1 U5.13(CHG)
N$66: R44.1 U5.14(LD)
Unconnected: U5.12(CHGU)

### Notes on the sheet
- Battery Protection
- BQ7790504

## Sheet 8 of 8: VREG
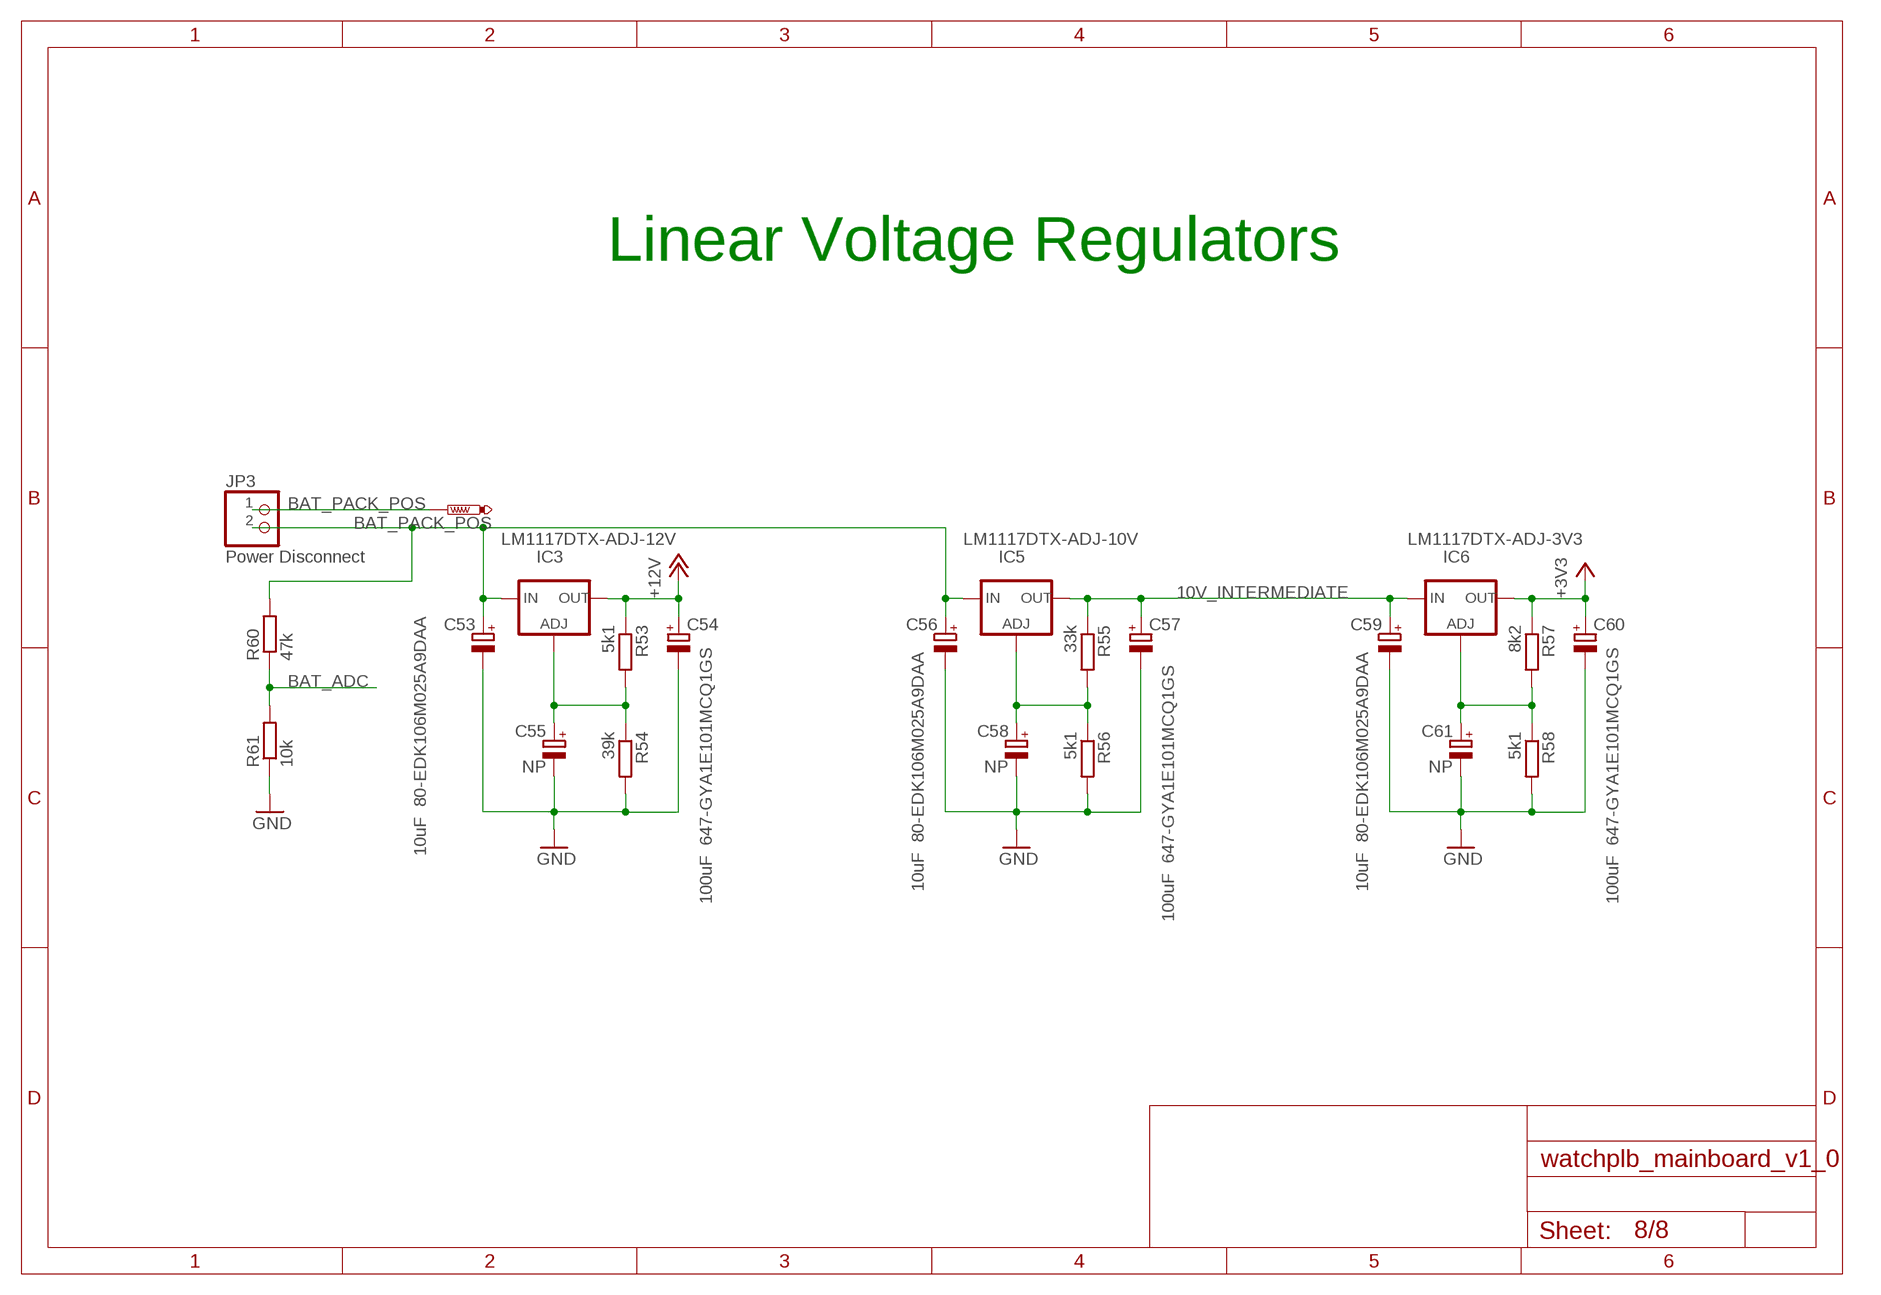
[diagram p7: schematic, sheet 8]

### Parts
BAT_PACK_POS  PTR1B1,27  [B1,27]
C53  10uF 80-EDK106M025A9DAA  CPOL-EUE  [PANASONIC_E]
C54  100uF 647-GYA1E101MCQ1GS  CPOL-EUE  [PANASONIC_E]
C55  NP  CPOL-EUE  [PANASONIC_E]
C56  10uF 80-EDK106M025A9DAA  CPOL-EUE  [PANASONIC_E]
C57  100uF 647-GYA1E101MCQ1GS  CPOL-EUE  [PANASONIC_E]
C58  NP  CPOL-EUE  [PANASONIC_E]
C59  10uF 80-EDK106M025A9DAA  CPOL-EUE  [PANASONIC_E]
C60  100uF 647-GYA1E101MCQ1GS  CPOL-EUE  [PANASONIC_E]
C61  NP  CPOL-EUE  [PANASONIC_E]
IC3  LM1117DTX-ADJ-12V  LM1117DTX-ADJ  [TO252]
IC5  LM1117DTX-ADJ-10V  LM1117DTX-ADJ  [TO252]
IC6  LM1117DTX-ADJ-3V3  LM1117DTX-ADJ  [TO252]
JP3  Power Disconnect  PINHD-1X2  [1X02]
R53  5k1  R-EU_M0805  [M0805]
R54  39k  R-EU_M0805  [M0805]
R55  33k  R-EU_M0805  [M0805]
R56  5k1  R-EU_M0805  [M0805]
R57  8k2  R-EU_M0805  [M0805]
R58  5k1  R-EU_M0805  [M0805]
R60  47k  R-EU_M0805  [M0805]
R61  10k  R-EU_M0805  [M0805]

### Nets
10V_INTERMEDIATE: C57.+ C59.+ IC5.TAB(OUT) IC6.2(IN) R55.1
+3V3: C60.+ IC6.TAB(OUT) R57.1 ; also sheet 1,2,3,4,5,6
+12V: C54.+ IC3.TAB(OUT) R53.1 ; also sheet 2
BAT_ADC: R60.1 R61.2 ; also sheet 1
BAT_PACK_POS: BAT_PACK_POS.TP JP3.1 ; also sheet 5,7
GND: C53.- C54.- C55.- C56.- C57.- C58.- C59.- C60.- C61.- R54.2 R56.2 R58.2 R61.1 ; also sheet 1,2,3,4,5,6,7
N$84: C53.+ C56.+ IC3.2(IN) IC5.2(IN) JP3.2 R60.2
N$85: C55.+ IC3.1(ADJ) R53.2 R54.1
N$89: C58.+ IC5.1(ADJ) R55.2 R56.1
N$92: C61.+ IC6.1(ADJ) R57.2 R58.1

### Notes on the sheet
- Linear Voltage Regulators

## Library data of the parts
3V3 BAT_ADC BAT_PACK_POS BT_RX BT_TX BTN_1-BTN_4 BTN_NRST NRST_MCU RF_SIGNAL RF_SYSCLK SPI2_CLK SPI2_IRQ SPI2_MISO SPI2_MOSI SPI2_SEL_RFTX SWD_RXD SWD_TXD USB_DN USB_DP USB_ID = testpad:PTR1: TEST PIN
B1 B3-B7 = PCB4_Demoboard:B-EU_: EMI Filter
BAT CONFIG_INTERFACE_TEST_POINT PR0> = pinhead:PINHD-1X5: PIN HEADER
C4-C18 C20-C47 C49 = resistor:C-EU: CAPACITOR, European symbol
C19 = 12mhz osc:CSTCE8M00G52-R0; MANUFACTURER_PART_NUMBER: CSTCE8M00G52R0; VENDOR: Murata
C48 C51-C61 C63 = rcl:CPOL-EU: POLARIZED CAPACITOR, European symbol
D1 = diode:DIODE-: DIODE
D2-D5 D8 D9 = adafruit:DIODE: Diode SMADIODE - SMA Surface Mount Package 20V 1A Schottky Diode Digikey: 641-1014-6-ND DO-1N4148 - Through Hole Small Current Diode SOD-123 20V 1 A (.5mV Vf) Schottky Diode - Digikey: MBRX120TPMSCT-ND SOD-323 10V 570mA (.38mV Vf, 3ns) Schottky Diode - Digikey: ZLLS410CT-ND SOD-523 30V 30mA Schottky Diode (RB751S-40TE61) - Digikey: RB751S-40TE61CT-ND SOT23-R/W - SOT23 Package (R = Solder Paste/Reflow Ovens, W = Hand-Soldering) BAT54Film 40V 300mA - Digikey: 497-7162-1-ND
D6 D7 = diode-1:DIODE-: DIODE
D10 = diode:MBRS3*0T3: SCHOTTKY BARRIER RECTIFIER 3.0 AMPERES 20, 30, 40 VOLT Source: MBRS340T3-D.pdf
FB1 FB3 FB4 = SparkFun-Coils:FERRITE_BEAD: Ferrite Bead (blocks, cores, rings, chokes, etc.) Inductor with layers of ferrite used to suppress high frequencies. Often used to isolate high frequency noise. SparkFun Products: IOIO-OTG - V2.2 <https://www.sparkfun.com/products/13613> SparkFun SAMD21 Mini Breakout <https://www.sparkfun.com/products/13664> SparkFun 6 Degrees of Freedom Breakout - LSM6DS3 <https://www.sparkfun.com/products/13339> SparkFun SAMD21 Dev Breakout <https://www.sparkfun.com/products/13672>; PROD_ID: NDUC-13805; VALUE: 30O/1.8A
GPS> = pinhead:PINHD-1X8: PIN HEADER
IC1 = Hick:LT1513: Battery Charger Buck/Boost
IC2 = BM70BLES1FC2-0B03AA:BM70BLES1FC2-0B03AA: Bluetooth / 802.15.1 Modules Source: Datasheet <http://ww1.microchip.com/downloads/en/DeviceDoc/60001372F.pdf>; DESCRIPTION: Bluetooth / 802.15.1 Modules; HEIGHT: mm; MANUFACTURER_NAME: Microchip; MANUFACTURER_PART_NUMBER: BM70BLES1FC2-0B03AA
IC3 IC5 IC6 = lm1117:LM1117DTX-ADJ
IC4 = Hick:AX5031: AX5031 RF Transmitter 400-470MHz 800-940MHz
J1 J2 J4 = SparkFun-Connectors:USB_MICRO-B: USB Type Micro-B Connector Male/female and PTH/SMT variants SparkFun Products: SparkFun microB USB Breakout <https://www.sparkfun.com/products/12035> SparkFun USB microB Plug Breakout <https://www.sparkfun.com/products/10031> SparkFun ESP8266 Thing <https://www.sparkfun.com/products/13231>; PROD_ID: CONN-11752
J3 = SparkFun-Connectors:BNC: BNC Right Angle Connector Mouser Part# 5227161 SparkFun Products: BNC Connector - Right Angle <https://www.sparkfun.com/products/10550>; PROD_ID: LPA-12729; SF_ID: PRT-10550
JP2 JP3 = pinhead:PINHD-1X2: PIN HEADER
L1-L7 = SparkFun-Coils:INDUCTOR: Inductors Resist changes in electrical current. Basically a coil of wire. SparkFun Products: SparkFun Load Cell Amplifier - HX711 <https://www.sparkfun.com/products/13879> IOIO-OTG - V2.2 <https://www.sparkfun.com/products/13613>; PROD_ID: NDUC-13076; VALUE: 3.3µH/±20%/450mA
L8 = CTX10-4A-R:CTX10-4A-R: POWER INDUCTOR; AVAILABILITY: Good; DESCRIPTION: Inductor Power Wirewound 10.53uH/42.11uH 25% 100KHz Amorphous Metal 4.67A/2.33A 20mOhm/81mOhm DCR T/R; MF: Eaton; MP: CTX10-4A-R; PACKAGE: Nonstandard Eaton; PRICE: 3.21 USD
LED1-LED12 = adafruit:LED: LED OSRAM: - CHIPLED LG R971, LG N971, LY N971, LG Q971, LY Q971, LO R971, LY R971 LH N974, LH R974 LS Q976, LO Q976, LY Q976 LO Q996 - Hyper CHIPLED LW Q18S LB Q993, LB Q99A, LB R99A - SideLED LS A670, LO A670, LY A670, LG A670, LP A670 LB A673, LV A673, LT A673, LW A673 LH A674 LY A675 LS A676, LA A676, LO A676, LY A676, LW A676 LS A679, LY A679, LG A679 - Hyper Micro SIDELED® LS Y876, LA Y876, LO Y876, LY Y876 LT Y87S - SmartLED LW L88C, LW L88S LB L89C, LB L89S, LG L890 LS L89K, LO L89K, LY L89K LS L896, LA L896, LO L896, LY L896 - TOPLED LS T670, LO T670, LY T670, LG T670, LP T670 LSG T670, LSP T670, LSY T670, LOP T670, LYG T670 LG T671, LOG T671, LSG T671 LB T673, LV T673, LT T673, LW T673 LH T674 LS T676, LA T676, LO T676, LY T676, LB T676, LH T676, LSB T676, LW T676 LB T67C, LV T67C, LT T67C, LS T67K, LO T67K, LY T67K, LW E67C LS E67B, LA E67B, LO E67B, LY E67B, LB E67C, LV E67C, LT E67C LW T67C LS T679, LY T679, LG T679 LS T770, LO T770, LY T770, LG T770, LP T770 LB T773, LV T773, LT T773, LW T773 LH T774 LS E675, LA E675, LY E675, LS T675 LS T776, LA T776, LO T776, LY T776, LB T776 LHGB T686 LT T68C, LB T68C - Hyper Mini TOPLED® LB M676 - Mini TOPLED Santana® LG M470 LS M47K, LO M47K, LY M47K Source: http://www.osram.convergy.de/
Q1 = crystal:CRYSTAL: CRYSTAL; OC_FARNELL: unknown; OC_NEWARK: unknown
Q2 = transistor-npn:BC817*: NPN Transistor
Q3 Q7 = transistor-small-signal:BSS123: N-CHANNEL MOS FET
Q4 = adafruit:CRYSTAL: CRYSTAL; OC_FARNELL: unknown; OC_NEWARK: unknown
Q5 Q6 = CSD18534Q5A:CSD18534Q5A: 60V N-Channel NexFET Power? MOSFET 8-VSON-FET -55 to 150; AVAILABILITY: Good; DESCRIPTION: 60V N-Channel NexFET Power? MOSFET 8-VSON-FET -55 to 150; MF: Texas Instruments; MP: CSD18534Q5A; PACKAGE: VSON-8 Texas Instruments; PRICE: 0.61 USD
R1-R62 = resistor:R-EU_: RESISTOR, European symbol
S1-S5 = Hick:TL3305: OMRON SWITCH; MOUSER-NR: 612-TL3305AF260QG; MPN: TL3305
U1 = MCP111-XXXTO:MCP111-XXXXX/TO
U2 = stm32l073rz_hoffentlich:STM32L0X3RL; MANUFACTURER_PART_NUMBER: stm32l0x3rl; VENDOR: STMicroelectronics
U3 = MCP2200-iSS:MCP2200-I/SS; MANUFACTURER_PART_NUMBER: mcp2200iss; VENDOR: Microchip
U4 = Texas Instruments_By_element14_Batch_1:TPD3E001DRLR: LOW-CAPACITANCE 3-CHANNEL ±15-kV ESD-PROTECTION ARRAY FOR HIGH-SPEED DATA INTERFACES; MPN: TPD3E001DRLR; OC_FARNELL: 1603422; OC_NEWARK: 41M5842; PACKAGE: SOT-5; SUPPLIER: Texas Instruments
U5 = chips:BQ77904: A battery protection chip with OV/UV/OT/UT; DIGIKEY: 296-44599-5-ND
U$2 = Hick:RA07H4047M